# Altium schematic sheet MicroController.SchDoc: MicroController
size A4; Revision: 1.1; SheetNumber: 2; SheetTotal: 4
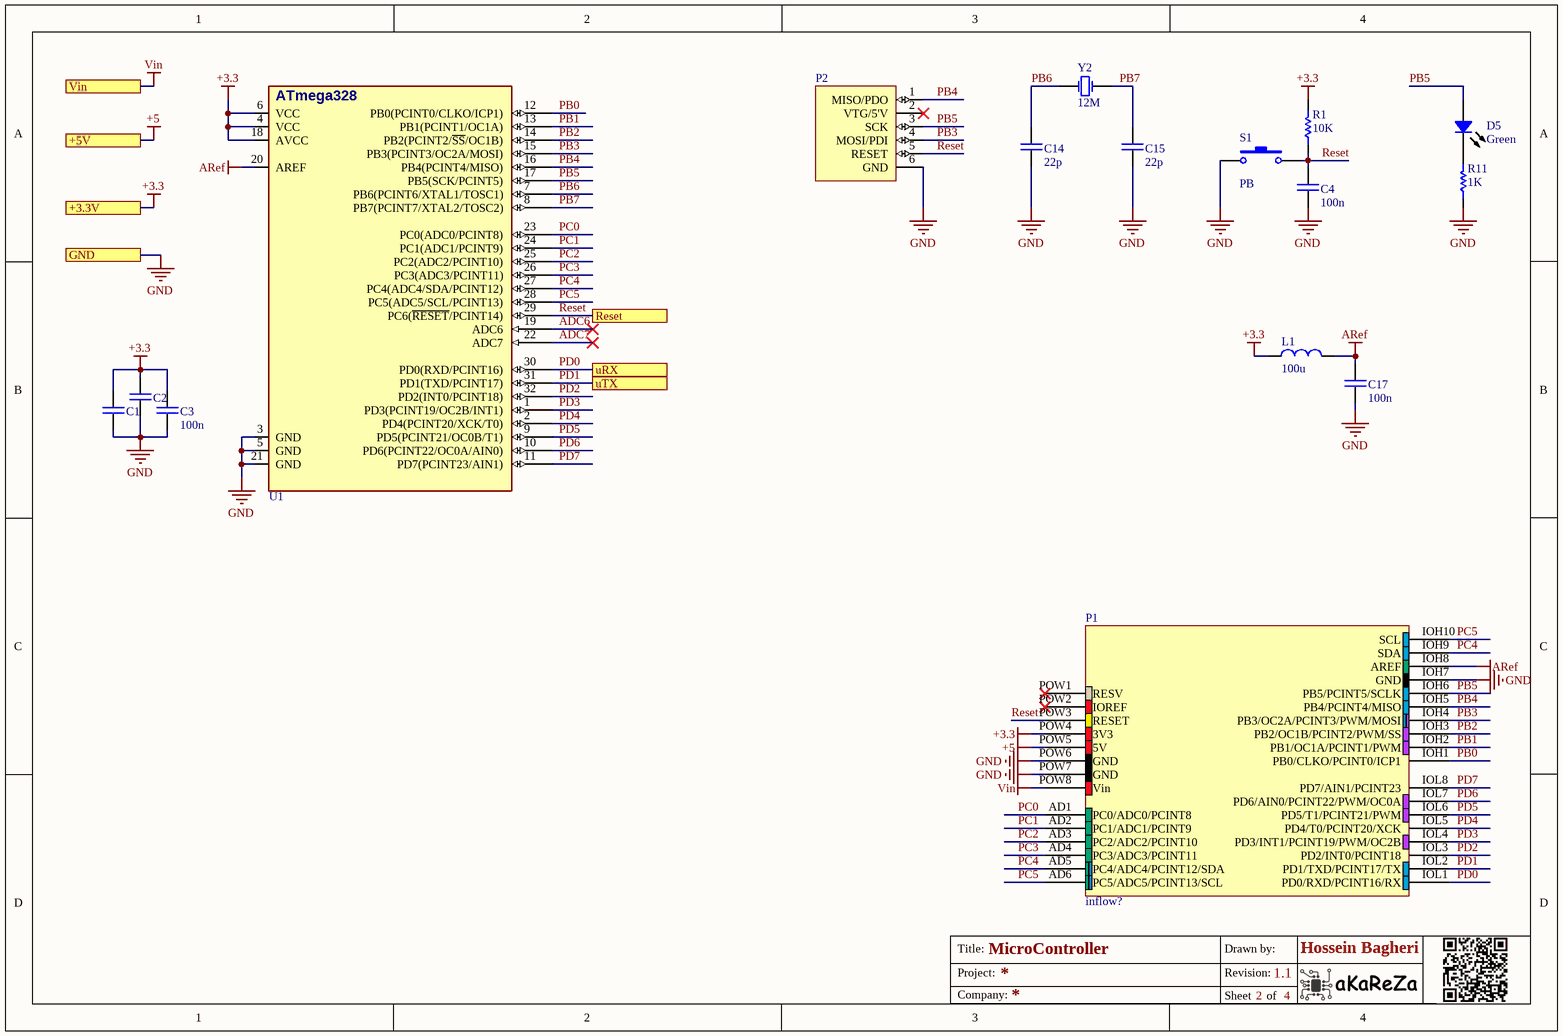
[diagram p0: MicroController.SchDoc]

## Parts
C1  100n  [CAP 0805/2012]  (value not drawn)
C2  100n  [CAP 0805/2012]  (value not drawn)
C3  100n  [CAP 0805/2012]
C4  100n  [CAP 0805/2012]
C14  22p  [CAP 0805/2012]
C15  22p  [CAP 0805/2012]
C17  100n  [CAP 0805/2012]
D5  Green  [LED 0805/2012 GREEN]
L1  100u  [IND0805]
P1  Inflow: inflow?  [ARDUINO_UNO_CONNECTOR]  (hidden comment: UNO)
P2  3x2  [IDC_2X3]  (value not drawn)
R1  10K  [RES 0805 (2012X06L)]
R11  1K  [RES 0805 (2012X06L)]
S1  PB  [SW_PB_SMD_2PIN_SPST_6X3X2]
U1  ATmega328P  [ATMEGA328]  (value not drawn)
Y2  12M  [Crystal SMD]

## Ports
+3.3V, +5V, GND, Reset, uRX, uTX, Vin

## Nets
+3.3: C1.1 C2.1 C3.1 L1.1 P1.POW4(3V3) R1.2 U1.4(VCC) U1.6(VCC) U1.18(AVCC) ; port +3.3V
+5: P1.POW5(5V) ; port +5V
ARef: C17.1 L1.2 P1.IOH8(AREF) U1.20(AREF)
GND: C1.2 C2.2 C3.2 C4.2 C14.2 C15.2 C17.2 P1.IOH7(GND) P1.POW6(GND) P1.POW7(GND) P2.6(GND) R11.1 S1.1 U1.3(GND) U1.5(GND) U1.21(GND) ; port GND
Vin: P1.POW8(Vin) ; port Vin
ADC6: U1.19(ADC6)
ADC7: U1.22(ADC7)
PB0: P1.IOH1(PB0/CLKO/PCINT0/ICP1) U1.12(PB0(PCINT0/CLKO/ICP1))
PB1: P1.IOH2(PB1/OC1A/PCINT1/PWM) U1.13(PB1(PCINT1/OC1A))
PB2: P1.IOH3(PB2/OC1B/PCINT2/PWM/SS) U1.14(PB2(PCINT2/~{SS}/OC1B))
PB3: P1.IOH4(PB3/OC2A/PCINT3/PWM/MOSI) P2.4(MOSI/PDI) U1.15(PB3(PCINT3/OC2A/MOSI))
PB4: P1.IOH5(PB4/PCINT4/MISO) P2.1(MISO/PDO) U1.16(PB4(PCINT4/MISO))
PB5: D5.1 P1.IOH6(PB5/PCINT5/SCLK) P2.3(SCK) U1.17(PB5(SCK/PCINT5))
PB6: C14.1 U1.7(PB6(PCINT6/XTAL1/TOSC1)) Y2.1(OSC1)
PB7: C15.1 U1.8(PB7(PCINT7/XTAL2/TOSC2)) Y2.2(OSC2)
PC0: P1.AD1(PC0/ADC0/PCINT8) U1.23(PC0(ADC0/PCINT8))
PC1: P1.AD2(PC1/ADC1/PCINT9) U1.24(PC1(ADC1/PCINT9))
PC2: P1.AD3(PC2/ADC2/PCINT10) U1.25(PC2(ADC2/PCINT10))
PC3: P1.AD4(PC3/ADC3/PCINT11) U1.26(PC3(ADC3/PCINT11))
PC4: P1.AD5(PC4/ADC4/PCINT12/SDA) P1.IOH9(SDA) U1.27(PC4(ADC4/SDA/PCINT12))
PC5: P1.AD6(PC5/ADC5/PCINT13/SCL) P1.IOH10(SCL) U1.28(PC5(ADC5/SCL/PCINT13))
PD0: P1.IOL1(PD0/RXD/PCINT16/RX) U1.30(PD0(RXD/PCINT16)) ; port uRX
PD1: P1.IOL2(PD1/TXD/PCINT17/TX) U1.31(PD1(TXD/PCINT17)) ; port uTX
PD2: P1.IOL3(PD2/INT0/PCINT18) U1.32(PD2(INT0/PCINT18))
PD3: P1.IOL4(PD3/INT1/PCINT19/PWM/OC2B) U1.1(PD3(PCINT19/OC2B/INT1))
PD4: P1.IOL5(PD4/T0/PCINT20/XCK) U1.2(PD4(PCINT20/XCK/T0))
PD5: P1.IOL6(PD5/T1/PCINT21/PWM) U1.9(PD5(PCINT21/OC0B/T1))
PD6: P1.IOL7(PD6/AIN0/PCINT22/PWM/OC0A) U1.10(PD6(PCINT22/OC0A/AIN0))
PD7: P1.IOL8(PD7/AIN1/PCINT23) U1.11(PD7(PCINT23/AIN1))
Reset: C4.1 P1.POW3(RESET) P2.5(RESET) R1.1 S1.2 U1.29(PC6(~{RESET}/PCINT14)) ; port Reset
NetD5_2: D5.2 R11.2

Not connected (* = marked no-connect by the designer): P1 POW1(RESV)* POW2(IOREF)*; P2 2(VTG/5'V)*

## Notes on the sheet
- Title:
- Project:
- Drawn by:
- Revision:
- Hossein Bagheri
- Company:
- Sheet
- of
- (in symbol IC_MCU_ATmega328P_SMD) ATmega328

## Library data of the parts
C1-C4 C17 = Cap_Multi_SMD_100nF_0805: Bipolar ceramic capacitor SMD; Inflow: inflow?; Type: MultiLayer; Rating: 50V; Validation: Valid; Package: 0805; Value: 100n
C14 C15 = Cap_Multi_SMD_0805: Bipolar ceramic capacitor SMD; Inflow: inflow?; Type: MultiLayer; Rating: Rating?; Validation: Valid; Package: 0805; Value: 22p
D5 = Semi_LED_SMD: LED; Inflow: inflow?; Rating: Rating?; Validation: Valid; Package: Package?; Type: LED; Value: Green
L1 = Ind_SMD_0805: Inductor; Inflow: inflow?; Type: SMD; Rating: Rating?; Validation: Valid; Package: 0805; Value: 100u
P1 = Con_Arduino_UNO_Con: Arduino UNO Connector; Rating: Rating?; Validation: NT; Value: UNO; Package: Package?; Type: Type?
P2 = Con_Prog_MKII_ISP: 6 Pin Standard ISP Header For MKII; Rating: Rating?; Validation: NT; Inflow: inflow?; Value: 3x2; Package: Package?; Type: Type?
R1 R11 = Res_SMD_0805: Resistor; Inflow: inflow?; Rating: 0.125W; Validation: Valid; Package: 0805; Type: 10%
  R1: Value: 10K
  R11: Value: 1K
S1 = SW_PushButton_2_SMD: SMT Tactile ‎Switch; Rating: 2b; Validation: Valid; Inflow: 8260; Type: Vertical; Package: SMD; Value: PB
U1 = IC_MCU_ATmega328P_SMD: 8-Bit AVR Microcontroller with 32K Bytes of In-System Programmable Flash Memory; Rating: Rating?; Validation: Valid; Inflow: inflow?; Value: ATmega328P; Package: Package?; Type: Type?
Y2 = Other_Elec_Xtal_SMD: Crystal Oscillator; Rating: Rating?; Inflow: inflow?; Validation: Valid; Package: SMD; Type: Quartz; Value: 12M